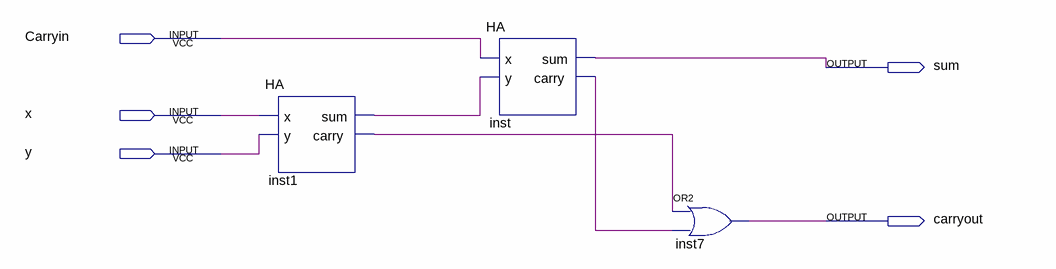
[diagram p0: schematic sheet]
// Quartus schematic FA.bdf as structural Verilog: 3 symbols, 5 pins
module FA (
  input  Carryin,
  input  x,
  input  y,
  output sum,
  output carryout
);

  wire inst1_carry, inst1_sum, inst_carry;

  HA inst1 (.x(x), .y(y), .sum(inst1_sum), .carry(inst1_carry));
  HA inst (.x(Carryin), .y(inst1_sum), .sum(sum), .carry(inst_carry));
  or inst7 (carryout, inst1_carry, inst_carry);
endmodule
